# Altium project Clipsal Iconic Alt Mech.PrjPcb
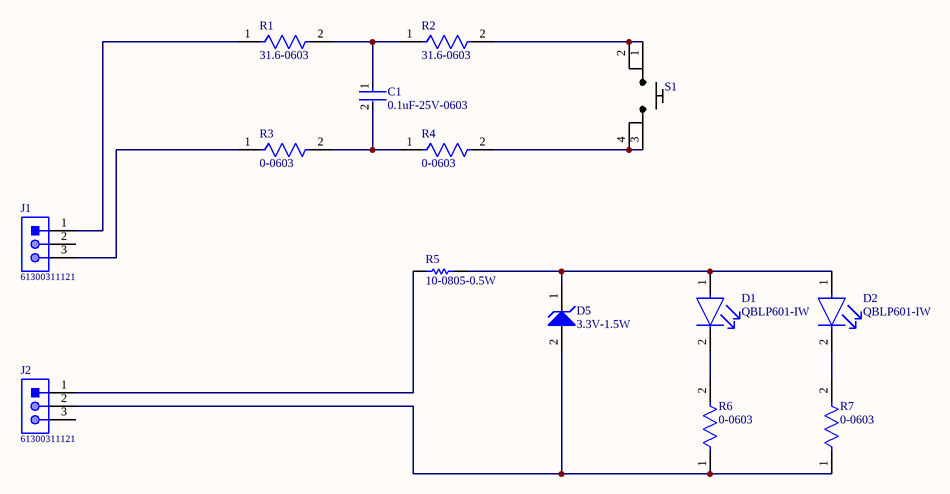
[diagram p0: Sheet1.SchDoc]
1 sheet, 14 parts. Net scope: global (net labels, ports and power ports of the same name join across sheets).
Board file: PCB1.PcbDoc

## Sheet Sheet1.SchDoc
size A4; SheetNumber: 1; SheetTotal: 1

### Parts
C1  0.1uF-25V-0603  [FP-C0603C-CF-MFG]
D1  QBLP601-IW  [FP-QBLP601-IW-MFG]
D2  QBLP601-IW  [FP-QBLP601-IW-MFG]
D5  3.3V-1.5W  [ONSC-SMA-2-403D-02_F_V]
J1  61300311121  [61300311121]
J2  61300311121  [61300311121]
R1  31.6-0603  [FP-RT0603-IPC_A]
R2  31.6-0603  [FP-RT0603-IPC_A]
R3  0-0603  [FP-RMCF0603-IPC_A]
R4  0-0603  [FP-RMCF0603-IPC_A]
R5  10-0805-0.5W  [RESC2013X70X40NL20T20]
R6  0-0603  [FP-RMCF0603-IPC_A]
R7  0-0603  [FP-RMCF0603-IPC_A]
S1  Switch  [E-Switch TL3305]  (value not drawn)

### Nets
NetC1_1: C1.1 R1.2 R2.1
NetC1_2: C1.2 R3.2 R4.1
NetD1_1: D1.1(A) D2.1(A) D5.1(K) R5.2
NetD1_2: D1.2(C) R6.2
NetD2_2: D2.2(C) R7.2
NetD5_2: D5.2(A) J2.2 R6.1 R7.1
NetJ1_1: J1.1 R1.1
NetJ1_3: J1.3 R3.1
NetJ2_1: J2.1 R5.1
NetR2_2: R2.2 S1.1 S1.2
NetR4_2: R4.2 S1.3 S1.4

Not connected (* = marked no-connect by the designer): J1 2; J2 3

### Library data of the parts
C1 = CMP-2006-02291-2: CAP CER 0.1UF 25V X7R 0603; Manufacturer: KEMET; Manufacturer Part Number: C0603C104K3RAC7411; Material: Ceramic; Value: 0.10 μF; Temperature Coefficient: 30ppm/°C; Automotive Grade: Grade 1; Tolerance: 0.1; Description: C0603 0.10 μF X7R 30ppm/°C 10.00% 25 V; Device Class L2: Capacitors; ComponentLink2URL: https://api.kemet.com/component-edge/download/datasheet/C0603C100J5GACAUTO.pdf; Device Class L3: Ceramic Capacitors; Capacitance: 0.10 μF; Octopart: https://octopart.com/c0603c104k3rac7411-kemet-9138804; Lead Free: Yes; Automotive: Yes; ComponentLink2Description: Datasheet; Temperature Characteristic: X7R; Height: 0.87mm; Temperature: -55°C to +125°C; Temperature Range High: +125°C; Temperature Range Low: -55°C; Category: Cap; Package: C0603C-CF; Device Class L1: Passive Components; RoHS: TRUE; Digikey Description: CAP CER 0.1UF 25V X7R 0603; Voltage Rating: 25 V; Mouser Description: Multilayer Ceramic Capacitors MLCC - SMD/SMT 25volts 0.1uF X7R 10%
D1 D2 = CMP-113271-000006-1: LED WHITE CLEAR 0603 SMD; Lens Size: 0.8mm; Luminous Intensity: 330mcd; Test Current: 20mA; Lens Color: Colorless; Lens Style: Flat; Forward Voltage: 3.2V; Case Code (Metric): 1608; Case/Package: 0603; Case Code (Imperial): 0603; Packaging: Tape and Reel; Mount: Surface Mount; Lens Transparency: Clear; Color: White; Height: 0.6mm; Width: 0.8mm; Length: 1.6mm
D5 = CMP-1060-00079-2: 1.5 W Zener Voltage Regulator, 2-Pin SMA, Pb-Free, Tape and Reel; Manufacturer: On Semiconductor; PartNumber: 1SMA5920BT3G; Value: 6.2V Zener; VZ Typ (V): 6.2; ComponentLink2Description: Datasheet; ComponentLink3Description: Package Specification; RoHS: Pb-Free; Mounting Technology: Surface Mount; PackageDescription: 2-Pin Small Molded Package, J-Bend Lead, Body 2.605 x 4.315 mm; PackageVersion: Rev. F, 11/2008; ComponentLink1Description: Manufacturer URL; ComponentLink1URL: http://www.onsemi.com/; PackageReference: SMA-2-403D-02_F; DatasheetVersion: Rev. 8; Packing: Tape and Reel; ComponentLink3URL: http://www.onsemi.com/pub_link/Collateral/1SMA5913BT3-D.PDF; ComponentLink2URL: http://www.onsemi.com/pub_link/Collateral/1SMA5913BT3-D.PDF
J1 J2 = CMP-1502-01062-1: THT Vertical Pin Header WR-PHD, Pitch 2.54 mm, Single Row, 3 pins; Manufacturer: Wurth Elektronik; Withstanding Voltage: 500VAC; Working Voltage: 250VAC; Rated Current: 3A; Pitch: 2.54mm; Pin Number: 3; Gender: Male; Contact Resistance: 20mOhm; Package Reference: 61300311121; Manufacturer URL: http://www.we-online.de; Datasheet URL: https://katalog.we-online.de/em/datasheet/6130xx11121.pdf; Operating Temperature: -40to105degC; Part Number: 61300311121; Orientation: Vertical; Packaging: Bag; Row Number: Single; Mounting Technology: THT; Publisher: WurthElektronik
R1 R2 = CMP-03412-007392-1: RES SMD 31.6 OHM 0.5% 1/10W 0603; Manufacturer Part Number: RT0603DRD0731R6L; Manufacturer: Yageo; Description: RT0603 31.6Ω 0.1W 25 ppm/°C 0.50%; Temperature Coefficient: 25 ppm/°C; Voltage Rating: 75V; Power Rating: 0.1W; Resistance: 31.6Ω; Value: 31.6Ω; Tolerance: 0.005; RoHS: TRUE; Footprint Url: http://www.yageo.com/exep/pages/download/literatures/PYu-R_Mount_10.pdf; Temperature Range Low: -55°C; ComponentLink2Description: Datasheet; Lead Free: Yes; Digikey Description: RES SMD 31.6 OHM 0.5% 1/10W 0603; Device Class L2: Resistors; Temperature Range High: +155°C; Composition: Thin Film; Height: 0.55mm; ComponentLink2URL: http://www.yageo.com/documents/recent/PYu-RT_1-to-0.01_RoHS_L_9.pdf; Category: Res; Device Class L3: Chip SMD Resistors; Automotive: No; Package: RT0603; Ipc Land Pattern Name: RESC16080X45; Series: RT; Device Class L1: Passive Components; Octopart: https://octopart.com/rt0603drd0731r6l-yageo-1240423; Temperature: -55°C to +155°C
R3 R4 R6 R7 = CMP-26527-000011-1: RES 0 OHM JUMPER 1/10W 0603; Manufacturer Part Number: RMCF0603ZT0R00; Manufacturer: Stackpole; Description: 0 Ohms Jumper 0.1W, 1/10W Chip Resistor 0603 (1608 Metric) Automotive AEC-Q200 Thick Film; Power Rating: 0.1W; Voltage Rating: 75V; Resistance: 0mΩ; Automotive Grade: Grade 0; Value: 0mΩ; Series: RMCF; Device Class L1: Passive Components; Device Class L3: Chip SMD Resistors; Octopart: https://octopart.com/rmcf0603zt0r00-stackpole+electronics-19213618; Temperature: -55°C to +155°C; Lead Free: Yes; ComponentLink2URL: https://www.seielect.com/catalog/sei-rmcf_rmcp.pdf; Height: 0.55mm; Composition: Thick Film; Package: RMCF0603; Automotive: Yes; Temperature Range High: +155°C; Ipc Land Pattern Name: RESC15580X45; Digikey Description: RES 0 OHM JUMPER 1/10W 0603; RoHS: TRUE; ComponentLink2Description: Datasheet; Temperature Range Low: -55°C; Category: Res; Device Class L2: Resistors
R5 = CMP-2001-00475-1: Manufacturer: Panasonic; Part Number: ERJ-P06J100V
S1 = Switch: Supplier 1: Newark; Supplier Part Number 1: 84Y2774